# EasyEDA Pro project ProPrj_PDB-F800GS_2025-04-13.epro, schematic Schematic1

## Sheets
1 Power: Board Name: Board1; Create Date: 2025-03-15; Page Name: Power; Project Name: PDB-F800GS; Schematic Name: Schematic1; Update Date: 2025-03-16; Company: EasyEDA.com; Page Size: A4; Version: V1.0
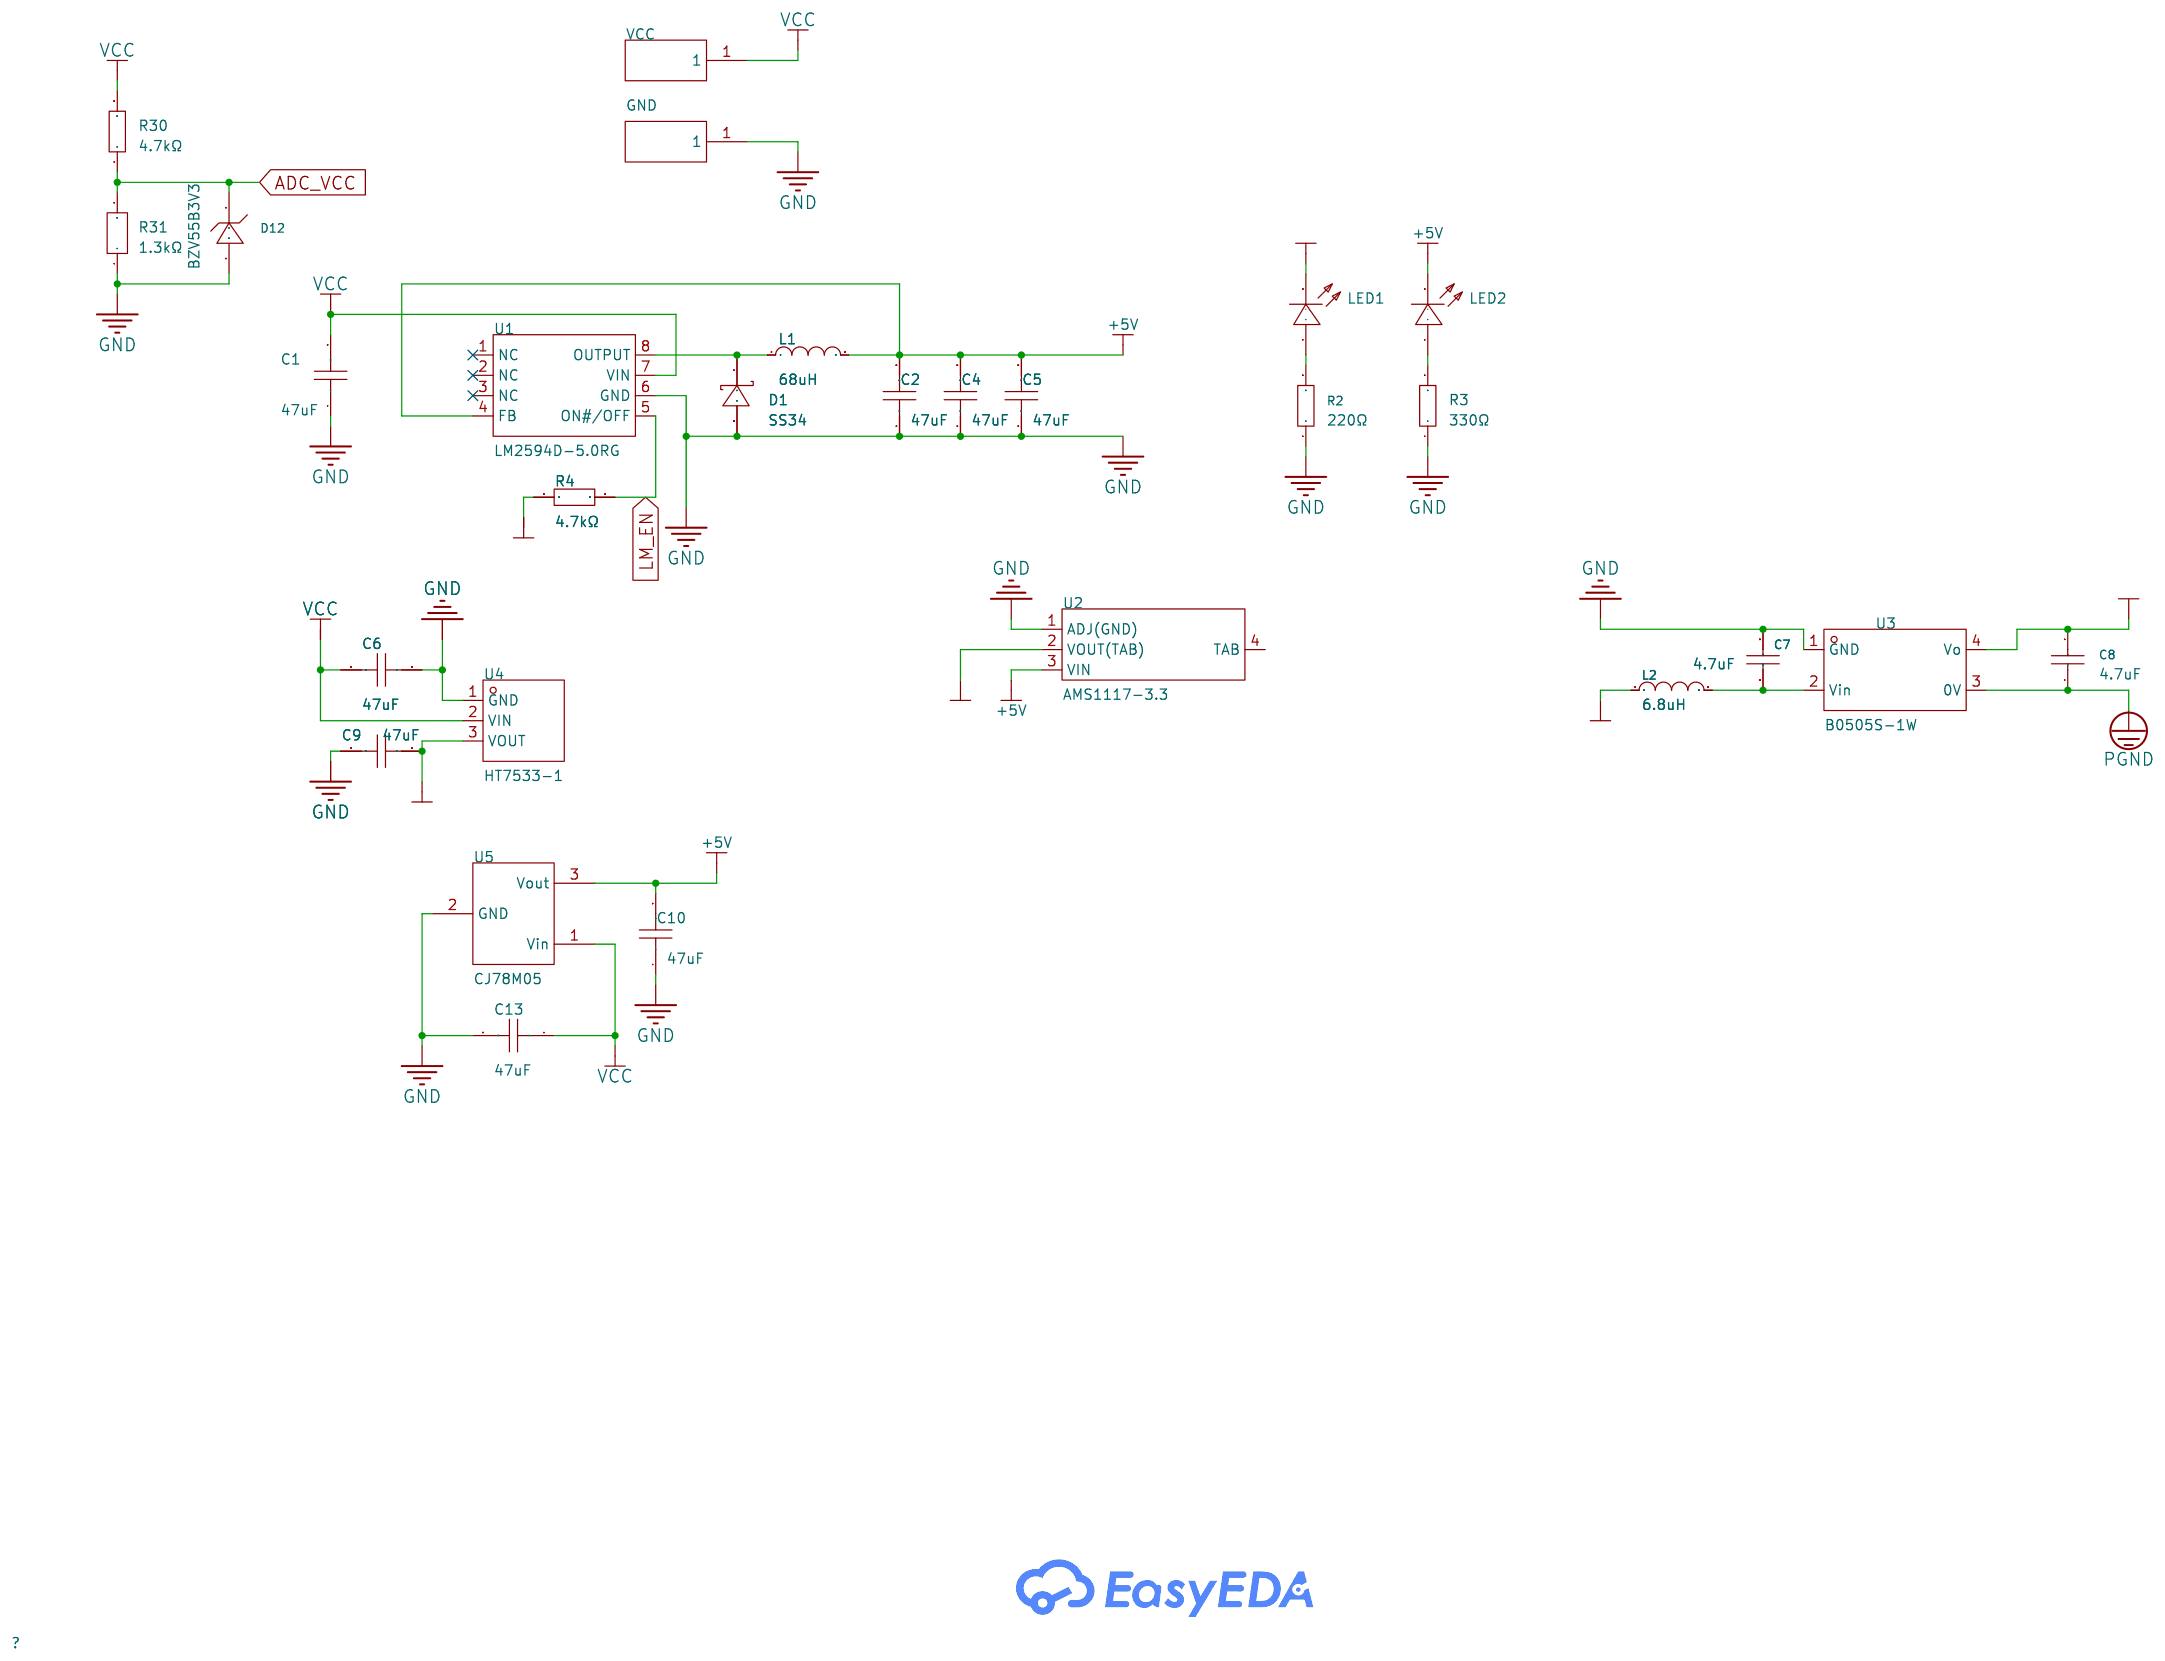
[diagram p0: Power]
2 Ports: Page Name: Ports
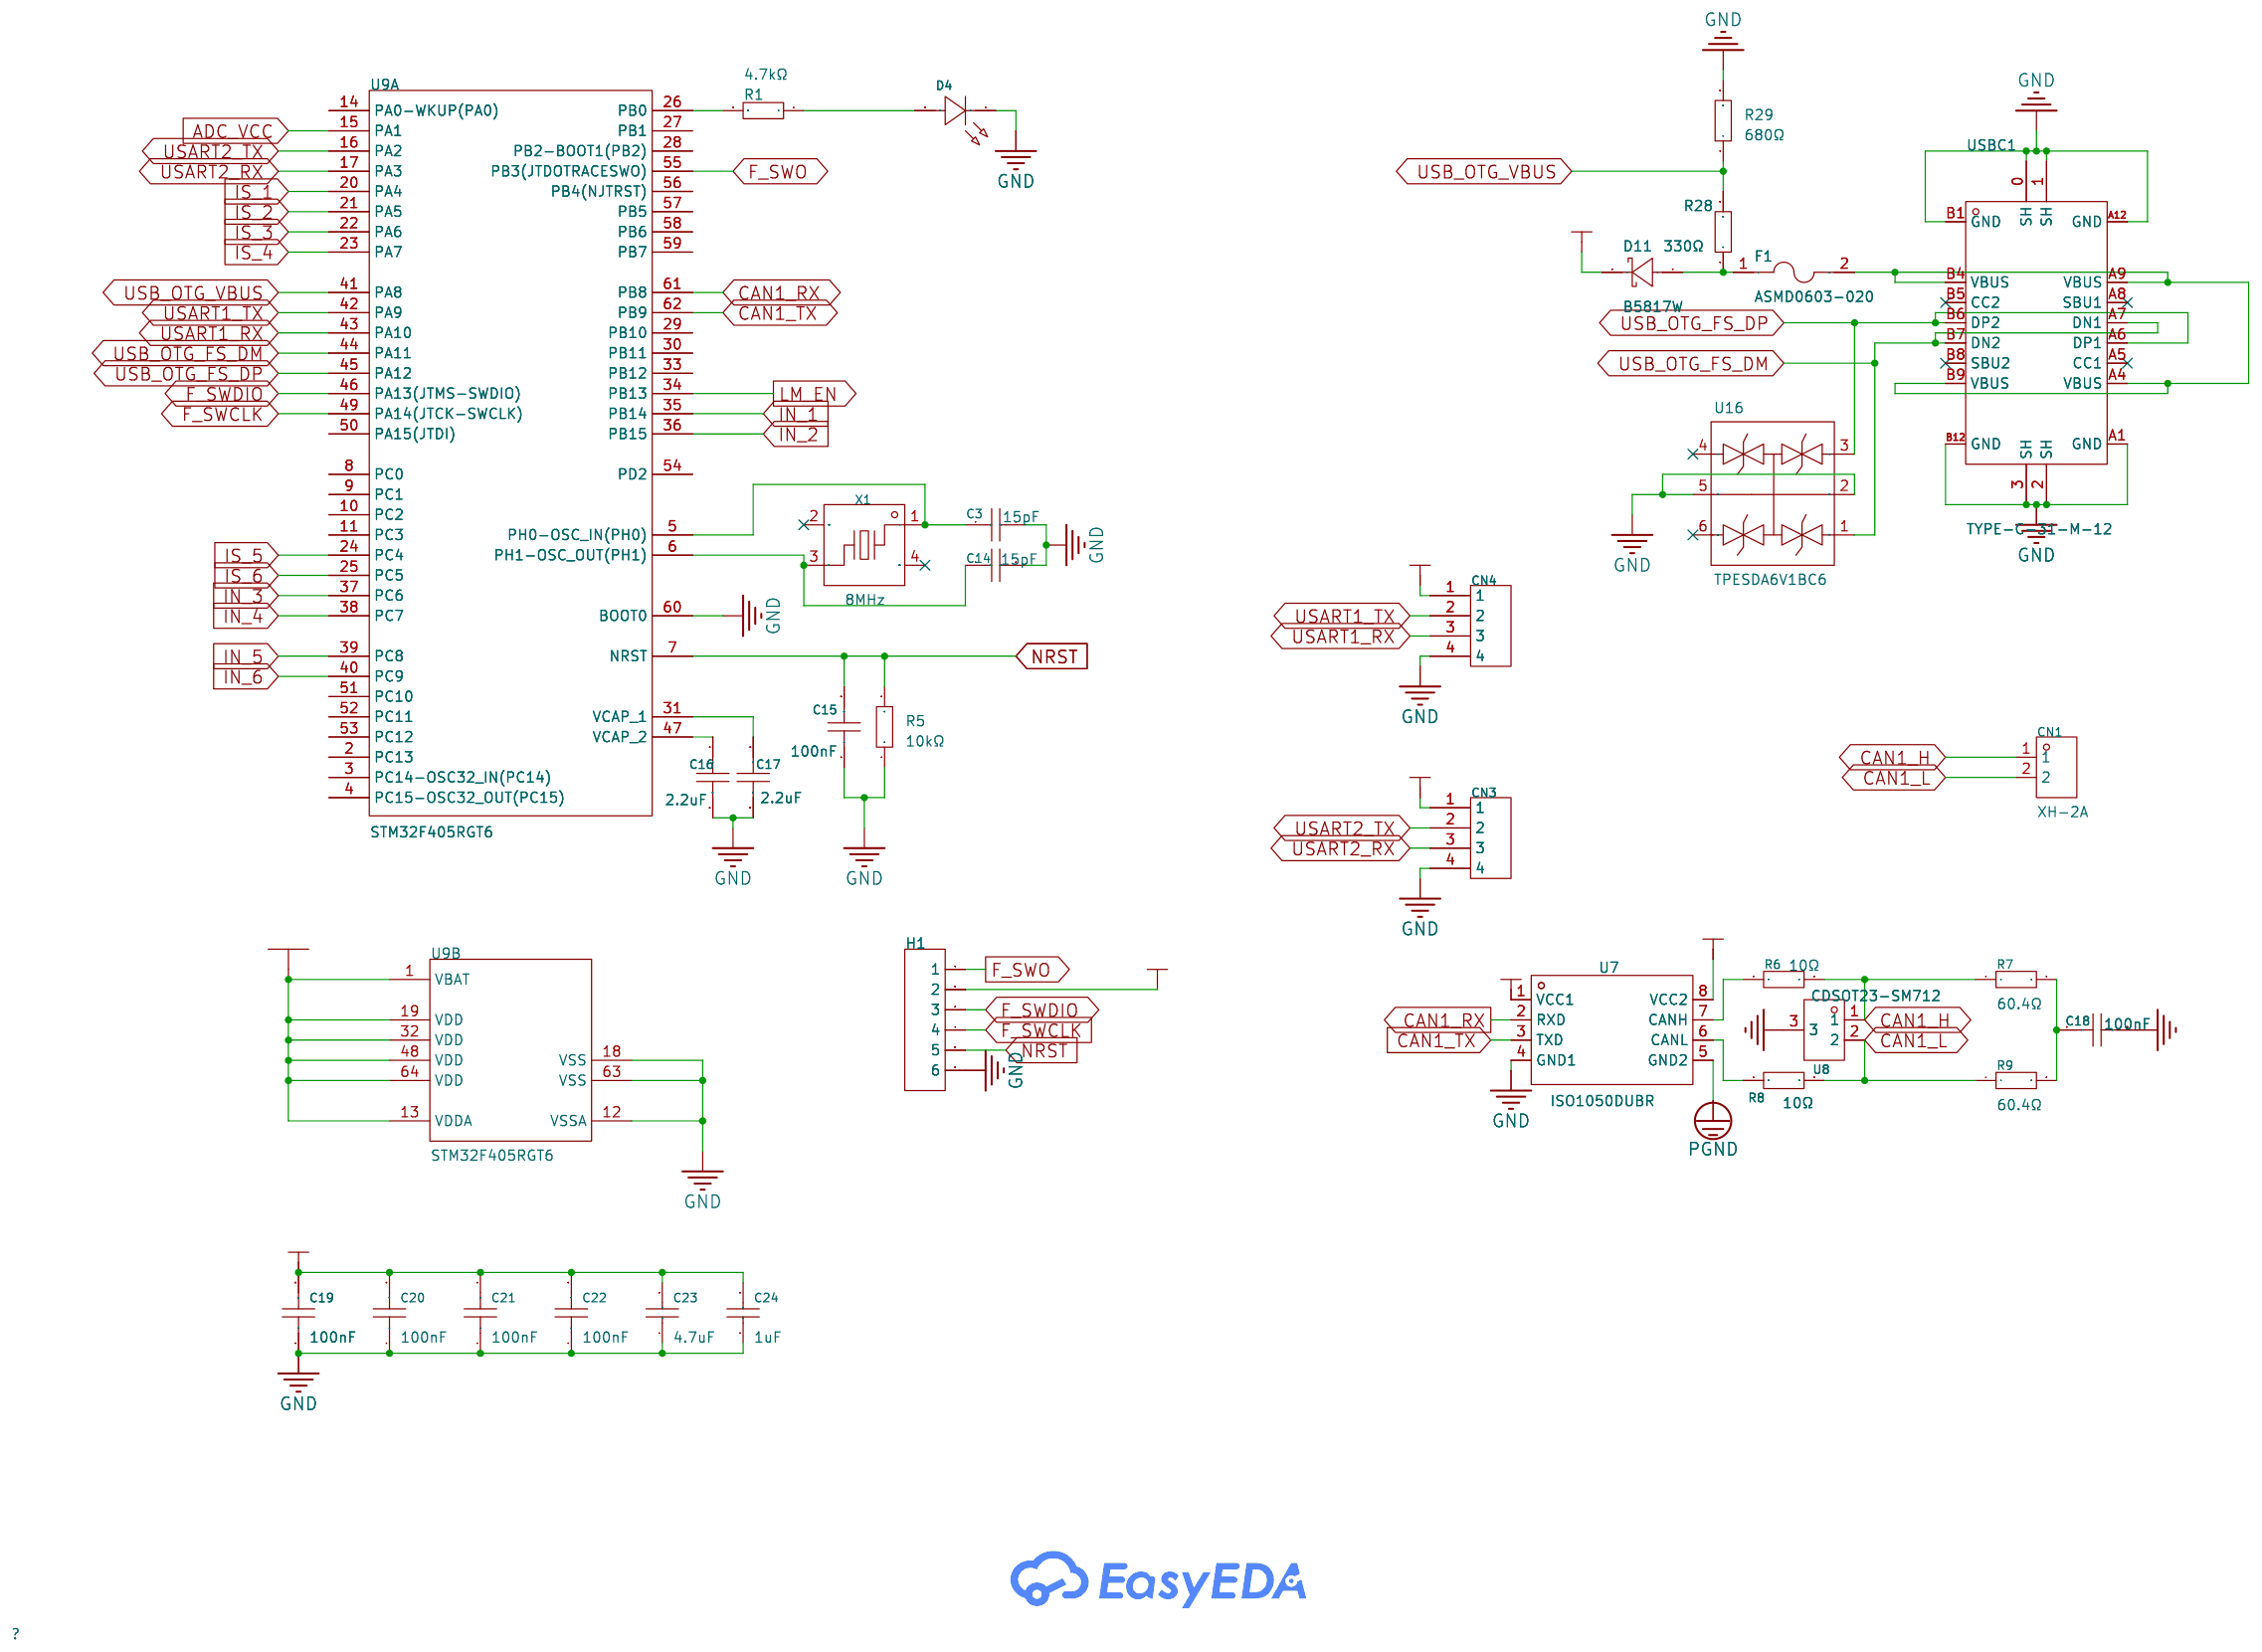
[diagram p1: Ports]
3 P3: Page Name: P3
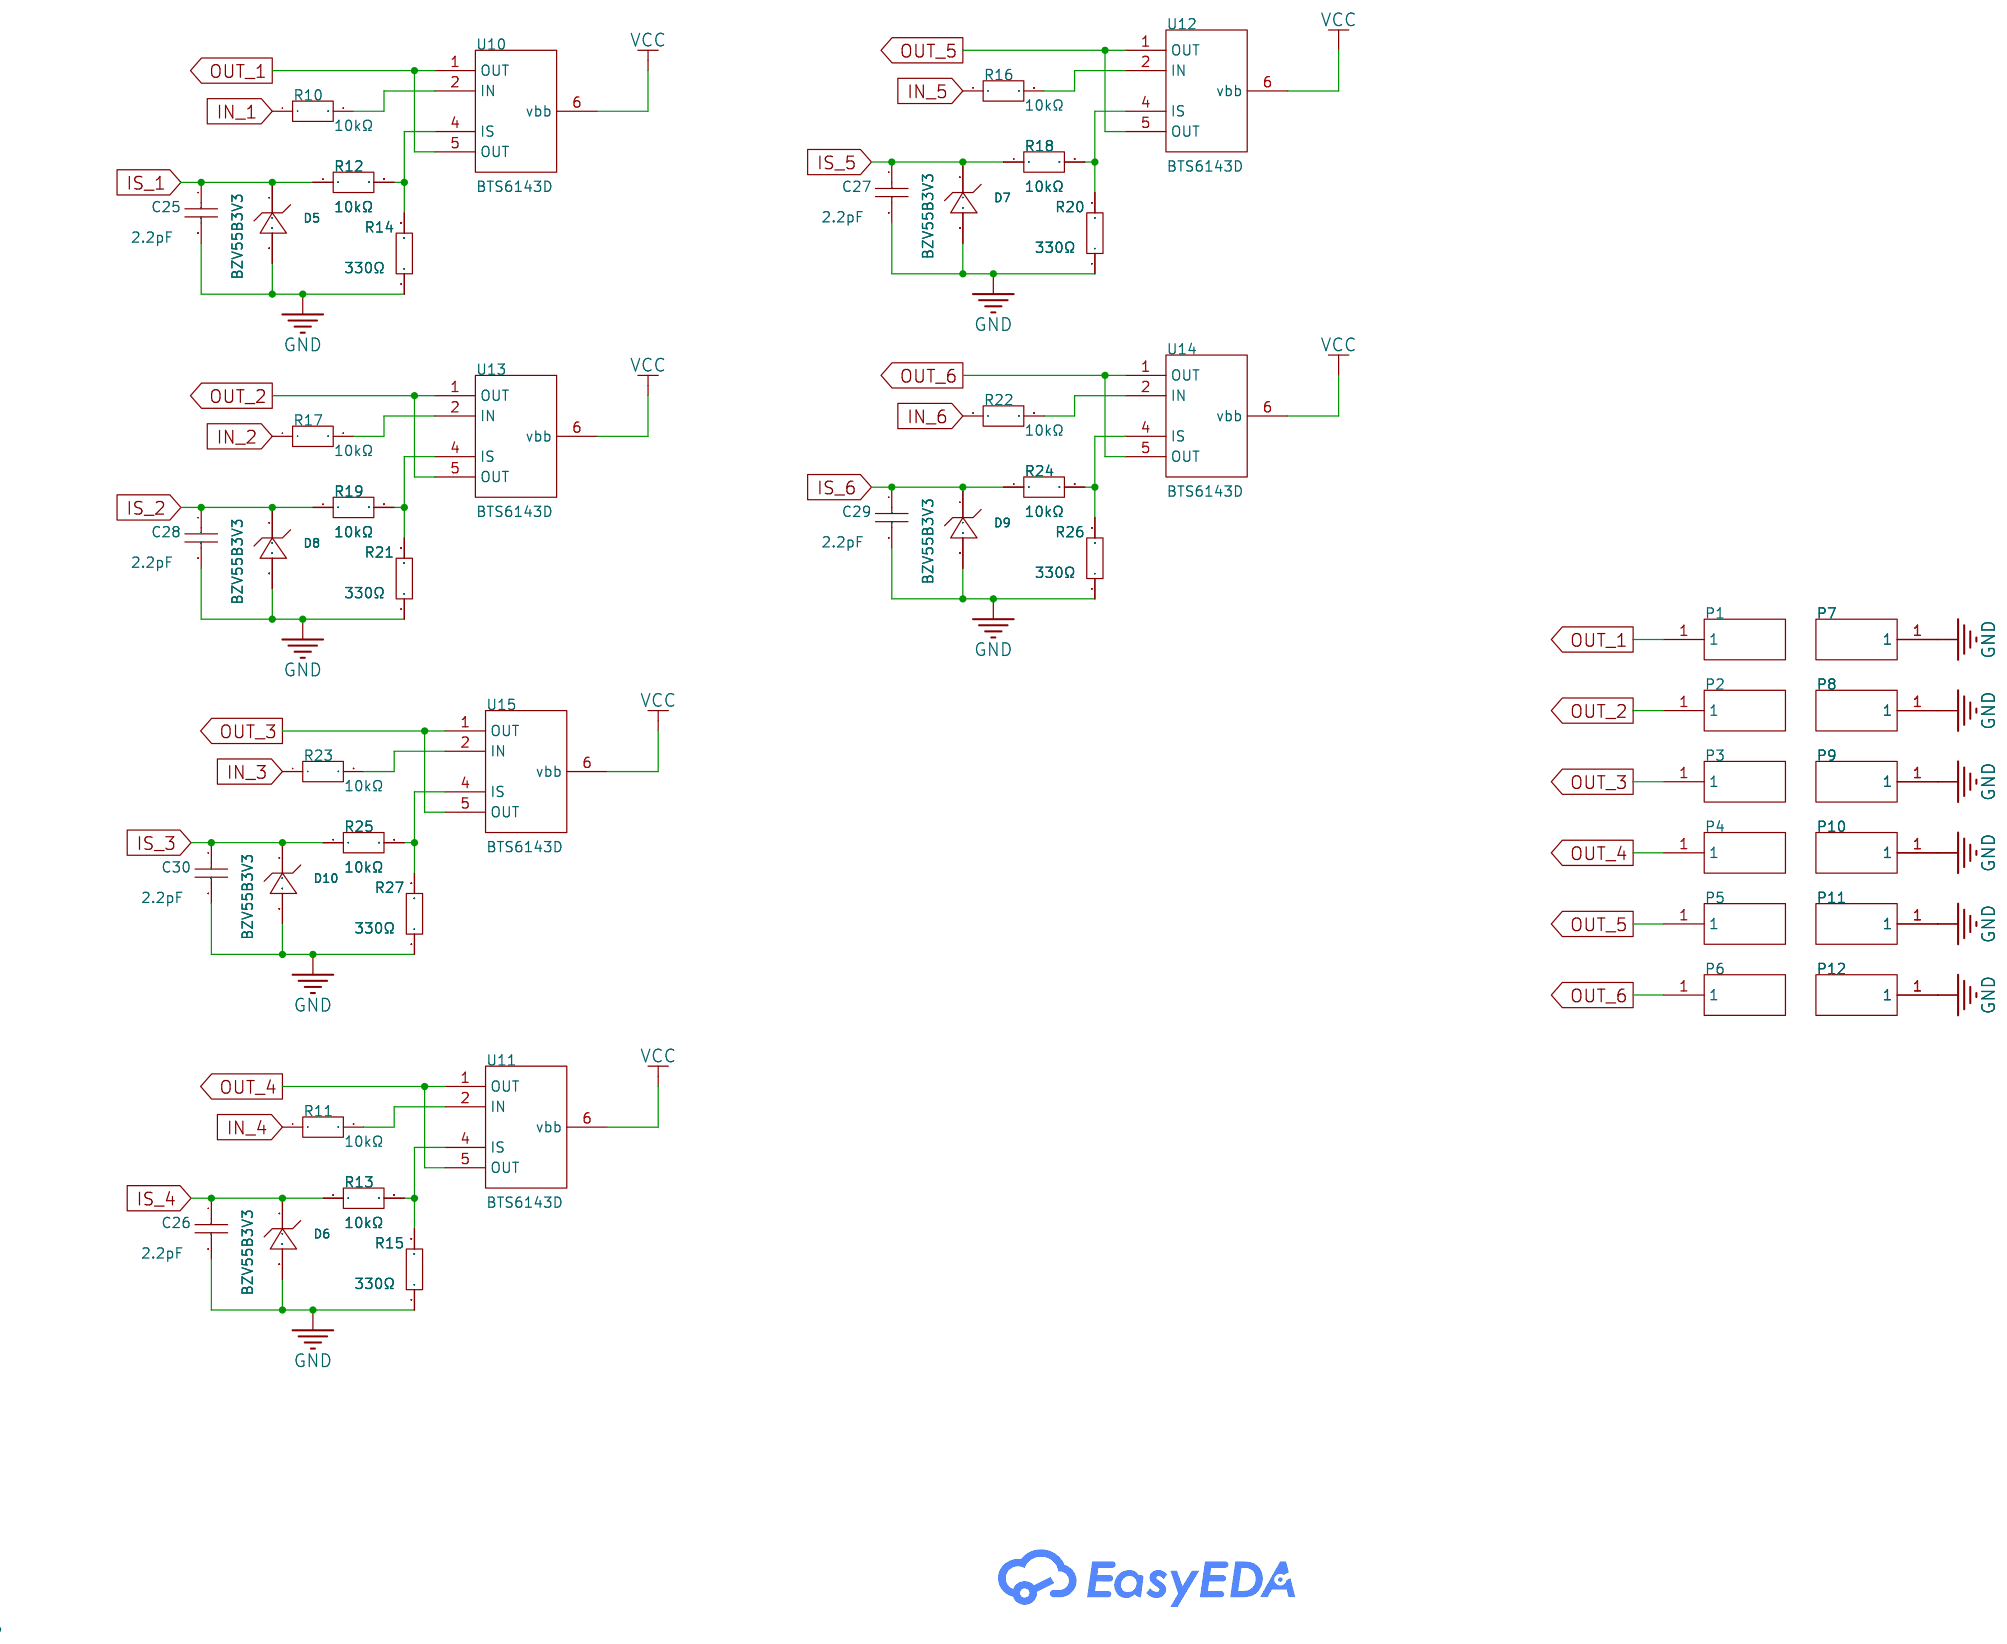
[diagram p2: P3]

## Parts
sheet P3
C25  2.2pF  [C0603]
C26  2.2pF  [C0603]
C27  2.2pF  [C0603]
C28  2.2pF  [C0603]
C29  2.2pF  [C0603]
C30  2.2pF  [C0603]
D5  BZV55B3V3  [SOD-80_L3.5-W1.5-RD]
D6  BZV55B3V3  [SOD-80_L3.5-W1.5-RD]
D7  BZV55B3V3  [SOD-80_L3.5-W1.5-RD]
D8  BZV55B3V3  [SOD-80_L3.5-W1.5-RD]
D9  BZV55B3V3  [SOD-80_L3.5-W1.5-RD]
D10  BZV55B3V3  [SOD-80_L3.5-W1.5-RD]
P1  -  [Wire pad 2x5 footprint]
P2  -  [Wire pad 2x5 footprint]
P3  -  [Wire pad 2x5 footprint]
P4  -  [Wire pad 2x5 footprint]
P5  -  [Wire pad 2x5 footprint]
P6  -  [Wire pad 2x5 footprint]
P7  -  [Wire pad 2x5 footprint]
P8  -  [Wire pad 2x5 footprint]
P9  -  [Wire pad 2x5 footprint]
P10  -  [Wire pad 2x5 footprint]
P11  -  [Wire pad 2x5 footprint]
P12  -  [Wire pad 2x5 footprint]
R10  10kΩ  [R0603]
R11  10kΩ  [R0603]
R12  10kΩ  [R0603]
R13  10kΩ  [R0603]
R14  330Ω  [R0603]
R15  330Ω  [R0603]
R16  10kΩ  [R0603]
R17  10kΩ  [R0603]
R18  10kΩ  [R0603]
R19  10kΩ  [R0603]
R20  330Ω  [R0603]
R21  330Ω  [R0603]
R22  10kΩ  [R0603]
R23  10kΩ  [R0603]
R24  10kΩ  [R0603]
R25  10kΩ  [R0603]
R26  330Ω  [R0603]
R27  330Ω  [R0603]
U10  BTS6143D  [TO-252-5_L6.5-W6.1-P1.14-LS10.0-BR]
U11  BTS6143D  [TO-252-5_L6.5-W6.1-P1.14-LS10.0-BR]
U12  BTS6143D  [TO-252-5_L6.5-W6.1-P1.14-LS10.0-BR]
U13  BTS6143D  [TO-252-5_L6.5-W6.1-P1.14-LS10.0-BR]
U14  BTS6143D  [TO-252-5_L6.5-W6.1-P1.14-LS10.0-BR]
U15  BTS6143D  [TO-252-5_L6.5-W6.1-P1.14-LS10.0-BR]
sheet Ports
C3  15pF  [C0603]
C14  15pF  [C0603]
C15  100nF  [C0603]
C16  2.2uF  [C0603]
C17  2.2uF  [C0603]
C18  100nF  [C0603]
C19  100nF  [C0603]
C20  100nF  [C0603]
C21  100nF  [C0603]
C22  100nF  [C0603]
C23  4.7uF  [C0603]
C24  1uF  [C0603]
CN1  XH-2A  [CONN-TH_XH-2A_C722856]
CN3  XH-4A  [CONN-TH_4P-P2.50_XH-4A]
CN4  XH-4A  [CONN-TH_4P-P2.50_XH-4A]
D4  XL-1608SURC-06  [LED0603-RD_RED]
D11  B5817W  [SOD-123_L2.7-W1.6-LS3.7-FD]
F1  ASMD0603-020  [F0603]
H1  2.54-1x6P直针  [HDR-TH_6P-P2.54-V-M-1]
R1  4.7kΩ  [R0603]
R5  10kΩ  [R0603]
R6  10Ω  [R0603]
R7  60.4Ω  [R0603]
R8  10Ω  [R0603]
R9  60.4Ω  [R0603]
R28  330Ω  [R0603]
R29  680Ω  [R0603]
U7  ISO1050DUBR  [SOIC-8_L9.3-W6.6-P2.54-LS10.4-BL]
U8  CDSOT23-SM712  [SOT-23-3_L2.9-W1.3-P0.95-LS2.4-BR]
U9  STM32F405RGT6  [LQFP-64_L10.0-W10.0-P0.50-LS12.0-BL]  (sections 1,2)
U16  TPESDA6V1BC6  [TSOT-23-6_L2.9-W1.6-P0.95-LS2.8-BL]
USBC1  TYPE-C-31-M-12  [USB-C_SMD-TYPE-C-31-M-12]
X1  8MHz  [OSC-SMD_4P-L3.2-W2.5-BL]
sheet Power
C1  47uF  [C1206]
C2  47uF  [C0805]
C4  47uF  [C0805]
C5  47uF  [C0805]
C6  47uF  [C1206]
C7  4.7uF  [C0603]
C8  4.7uF  [C0603]
C9  47uF  [C0805]
C10  47uF  [C0805]
C13  47uF  [C1206]
D1  SS34  [SMA_L4.3-W2.6-LS5.2-RD]
D12  BZV55B3V3  [SOD-80_L3.5-W1.5-RD]
GND  -  [Wire pad 2.54 x 6.35 footprint]
L1  68uH  [IND-SMD_L8.5-W8.0_SMS0850]
L2  6.8uH  [L0805]
LED1  SZYY0603Y  [LED0603-R-RD_YELLOW]
LED2  SZYY0603Y  [LED0603-R-RD_YELLOW]
R2  220Ω  [R0603]
R3  330Ω  [R0603]
R4  4.7kΩ  [R0603]
R30  4.7kΩ  [R0603]
R31  1.3kΩ  [R0603]
U1  LM2594D-5.0RG  [SOP-8_L4.9-W3.9-P1.27-LS6.0-BL]
U2  AMS1117-3.3  [SOT-223-4_L6.5-W3.5-P2.30-LS7.0-BR]
U3  B0505S-1W  [PWRM-TH_BXXXXS-1WR3]
U4  HT7533-1  [SOT-89_L4.5-W2.5-P1.50-LS4.2-BR]
U5  CJ78M05  [TO-252-3_L6.5-W5.8-P4.58-TL]
VCC  -  [Wire pad 2.54 x 6.35 footprint]

## Library data of the parts
C25-C30 = 0603CG2R2C500NT: Capacitance: Voltage Rated: Temperature Coefficient:; LCSC Part Name: 2.2pF 50V; Supplier Part: C1651; Manufacturer: FH(风华); Supplier Footprint: 0603; JLCPCB Part Class: Extended Part; Datasheet: https://atta.szlcsc.com/upload/public/pdf/source/20200305/C486355_26A10D38EF8C2A5C37091D0039909270.pdf; Supplier: LCSC
D5-D10 D12 = BZV55B3V3: Diode Configuration:Single Zener Voltage (Nom):- Reverse Leakage Current (Ir):2uA@1V Zener Voltage (Range):3.23V~3.37V Zener Voltage (Range):3.23V~3.37V Power Dissipation:500mW Zener Impedance (Zzt):85Ω Tolerance:- Tolerance:-; Supplier Part: C545375; Manufacturer: LGE(鲁光); Supplier Footprint: SOD-80; JLCPCB Part Class: Extended Part; Datasheet: https://atta.szlcsc.com/upload/public/pdf/source/20200521/C545327_60D3A6779D4B17AB00B9D32EC53EDD92.pdf; Supplier: LCSC; Diode Configuration: Single; Reverse Leakage Current (Ir): 2uA@1V; Zener Voltage (Range): 3.23V~3.37V; Power Dissipation: 500mW; Zener Impedance (Zzt): 85Ω
P1-P12 = Wire Pad 2x5
R10-R13 R16-R19 R22-R25 = FRC0603J103TS: Type:Thick Film Resistors Resistance:10kΩ Tolerance:±5% Tolerance:±5% Power(Watts): Overload Voltage (Max): Temperature Coefficient:±100ppm/℃ Temperature Coefficient:±100ppm/℃ Operating Temperature Range:-55℃~+155℃ Operating Temperature Range:-55℃~+155℃; LCSC Part Name: 10kΩ ±5% 100mW 厚膜电阻; Supplier Part: C2930027; Manufacturer: FOJAN(富捷); Supplier Footprint: 0603; JLCPCB Part Class: Extended Part; Datasheet: https://atta.szlcsc.com/upload/public/pdf/source/20211221/925EC7D7225764EE0046F22065062C87.pdf; Supplier: LCSC; Type: Thick Film Resistors; Tolerance: ±5%; Temperature Coefficient: ±100ppm/℃; Operating Temperature Range: -55℃~+155℃
R14 R15 R20 R21 R26-R28 = 0603WAF3300T5E: Type:Thick Film Resistors Resistance: Tolerance:±1% Tolerance:±1% Power(Watts): Overload Voltage (Max): Temperature Coefficient:±100ppm/℃ Temperature Coefficient:±100ppm/℃ Operating Temperature Range:-55℃~+155℃ Operating Temperature Range:-55℃~+155℃; LCSC Part Name: 330Ω ±1% 100mW 厚膜电阻; Supplier Part: C23138; Manufacturer: UNI-ROYAL(厚声); Supplier Footprint: 0603; JLCPCB Part Class: Basic Part; Datasheet: https://atta.szlcsc.com/upload/public/pdf/source/20200306/C422600_1E6D84923E4A46A82E41ADD87F860B5C.pdf; Supplier: LCSC; Type: Thick Film Resistors; Tolerance: ±1%; Temperature Coefficient: ±100ppm/℃; Operating Temperature Range: -55℃~+155℃
U10-U15 = BTS6143D: Type:High-side switch Number of Channels:1 Control Input Logic:Active Low Output Current:33A Voltage - Supply:5.5V~38V Voltage - Supply:5.5V~38V RDS(on):10mΩ Operating Temperature	-:-40℃~+150℃ Operating Temperature	-:-40℃~+150℃; Supplier Part: C95232; Manufacturer: Infineon(英飞凌); Supplier Footprint: TO-252-4; JLCPCB Part Class: Extended Part; Datasheet: https://atta.szlcsc.com/upload/public/pdf/source/20170217/1487301594741.pdf; Supplier: LCSC; Type: High-side switch; Number of Channels: 1; Control Input Logic: Active Low; Output Current: 33A; Voltage - Supply: 5.5V~38V; RDS(on): 10mΩ; Operating Temperature	-: -40℃~+150℃
C3 C14 = CC0603JRNPO9BN150: Capacitance: Tolerance:±5% Tolerance:±5% Voltage Rated: Temperature Coefficient:; LCSC Part Name: 15pF ±5% 50V; Supplier Part: C107037; Manufacturer: YAGEO(国巨); Supplier Footprint: 0603; JLCPCB Part Class: Extended Part; Datasheet: https://atta.szlcsc.com/upload/public/pdf/source/20170914/C128857_1505359892143968080.pdf; Supplier: LCSC; Tolerance: ±5%
C15 C18-C22 = CL10B104KC8NNNC: Capacitance: Tolerance:±10% Tolerance:±10% Voltage Rated: Temperature Coefficient:; LCSC Part Name: 100nF ±10% 100V; Supplier Part: C15725; Manufacturer: SAMSUNG(三星); Supplier Footprint: 0603; JLCPCB Part Class: Extended Part; Datasheet: https://atta.szlcsc.com/upload/public/pdf/source/20160218/1457707763339.pdf; Supplier: LCSC; Tolerance: ±10%
C16 C17 = CL10A225KB8NNNC: Capacitance: Tolerance:±10% Tolerance:±10% Voltage Rated: Temperature Coefficient:; LCSC Part Name: 2.2uF ±10% 50V; Supplier Part: C913904; Manufacturer: SAMSUNG(三星); Supplier Footprint: 0603; JLCPCB Part Class: Extended Part; Datasheet: https://atta.szlcsc.com/upload/public/pdf/source/20160218/1457707763339.pdf; Supplier: LCSC; Tolerance: ±10%
C7 C8 C23 = CL10A475KO8NNNC: Capacitance: Tolerance:±10% Tolerance:±10% Voltage Rated: Temperature Coefficient:; LCSC Part Name: 4.7uF ±10% 16V; Supplier Part: C19666; Manufacturer: SAMSUNG(三星); Supplier Footprint: 0603; JLCPCB Part Class: Basic Part; Datasheet: https://atta.szlcsc.com/upload/public/pdf/source/20160218/1457707763339.pdf; Supplier: LCSC; Tolerance: ±10%
C24 = CL10A105KO8NNNC: Capacitance: Tolerance:±10% Tolerance:±10% Voltage Rated: Temperature Coefficient:; LCSC Part Name: 1uF ±10% 16V; Supplier Part: C1592; Manufacturer: SAMSUNG(三星); Supplier Footprint: 0603; JLCPCB Part Class: Extended Part; Datasheet: https://atta.szlcsc.com/upload/public/pdf/source/20220919/9FBE606BE0D9532D730F292EB26DC5BB.pdf; Supplier: LCSC; Tolerance: ±10%
CN1 = XH-2A_C722856: Pins Structure:1x2P Pitch:2.5mm Mounting Style:Straight Reference Series:- Number of Pins:2P Number of Rows:1 Number of PINs Per Row:2 Row Spacing:- Current Rating (Max):2A Operating Temperature Range:-25℃~+85℃ Operating Temperature Range:-25℃~+85℃; LCSC Part Name: 1x2P 间距:2.5mm 直插; Supplier Part: C722856; Manufacturer: CAX(创都); Supplier Footprint: 插件,P=2.5mm; JLCPCB Part Class: Extended Part; Datasheet: https://atta.szlcsc.com/upload/public/pdf/source/20200831/C722856_9D7340CDD20AA9916EABC83BD7BA9E94.pdf; Supplier: LCSC; Pins Structure: 1x2P; Pitch: 2.5mm; Mounting Style: Straight; Number of Pins: 2P; Number of Rows: 1; Number of PINs Per Row: 2; Current Rating (Max): 2A; Operating Temperature Range: -25℃~+85℃
CN3 CN4 = XH-4A_C37815: Pins Structure:1x4P Pitch:2.5mm Mounting Style:- Reference Series:XH Number of Pins:4P Number of Rows:1 Number of PINs Per Row:4 Row Spacing:- Contact Material:Phosphor bronze; LCSC Part Name: 系列:XH 间距:2.5mm 1x4P; Supplier Part: C37815; Manufacturer: BOOMELE(博穆精密); Supplier Footprint: 插件,P=2.5mm; JLCPCB Part Class: Extended Part; Datasheet: https://atta.szlcsc.com/upload/public/pdf/source/20181205/C146112_2CB31444E6250AC61E2A41A9A8391D5F.pdf; Supplier: LCSC; Pins Structure: 1x4P; Pitch: 2.5mm; Reference Series: XH; Number of Pins: 4P; Number of Rows: 1; Number of PINs Per Row: 4; Contact Material: Phosphor bronze
D4 = XL-1608SURC-06: Emitted Color:Red Power Dissipation:55mW Forward Current:25mA Dominant Wavelength:617nm~621nm Dominant Wavelength:617nm~621nm Peak Wavelength:623nm Lens Color:无色透明透镜 Color Temperature:- Color Temperature:- Viewing Angle:120° Mounting Sytle:Positive post O; Supplier Part: C965799; Manufacturer: XINGLIGHT(成兴光); Supplier Footprint: 0603; JLCPCB Part Class: Extended Part; Datasheet: https://atta.szlcsc.com/upload/public/pdf/source/20221102/D860AFDD1CDB02C5A8064103A32707E2.pdf; Supplier: LCSC; Emitted Color: Red; Power Dissipation: 55mW; Forward Current: 25mA; Dominant Wavelength: 617nm~621nm; Peak Wavelength: 623nm; Lens Color: 无色透明透镜; Viewing Angle: 120°; Mounting Sytle: Positive post; Operating Temperature: -30℃~+85℃
D11 = B5817W_C7420328: Diode Configuration:Independent Type Forward Voltage (Vf@If):450mV@1.0A Reverse Voltage (Vr):20V Rectified Current:1A Reverse Leakage Current (Ir):1mA@20V; LCSC Part Name: 电压:20V 电流:1A; Supplier Part: C7420328; Manufacturer: 宏迦橙; Supplier Footprint: SOD-123; JLCPCB Part Class: Extended Part; Datasheet: https://atta.szlcsc.com/upload/public/pdf/source/20230828/EE0D571642CD3E42C48F1182066654A1.pdf; Supplier: LCSC; Diode Configuration: Independent Type; Forward Voltage (Vf@If): 450mV@1.0A; Reverse Voltage (Vr): 20V; Rectified Current: 1A; Reverse Leakage Current (Ir): 1mA@20V
F1 = ASMD0603-020: Voltage - Max:9V Current - Max:40A Hold Current:200mA Trip Current:500mA Power Dissipation:500mW Resistance - Initial (Ri) (Min):550mΩ Resistance - Post Trip (R1) (Max):3.5Ω Time to Trip(Max):600ms Operating Temperature:-40℃~+85℃ Operating Temperature:-40; LCSC Part Name: 9V 200mA 0603自恢复; Supplier Part: C135321; Manufacturer: JDTfuse(集电通); Supplier Footprint: 0603; JLCPCB Part Class: Extended Part; Datasheet: https://atta.szlcsc.com/upload/public/pdf/source/20230515/E3BD72A3B3566E5D91D9E10B82E096BB.pdf; Supplier: LCSC; Voltage - Max: 9V; Current - Max: 40A; Hold Current: 200mA; Trip Current: 500mA; Power Dissipation: 500mW; Resistance - Initial (Ri) (Min): 550mΩ; Resistance - Post Trip (R1) (Max): 3.5Ω; Time to Trip(Max): 600ms; Operating Temperature: -40℃~+85℃
H1 = 2.54-1x6P直针: Pin Structure:1x6P Pitch:2.54mm Row Spacing:- Circluar Pins/Square Pins:Square Pins Mounting Type:Straight Number of Rows:Plugin Number of Pins:6P Current Rating (Max):3A Voltage Rating (Max):- Length of Mating Pin:- Insulation Height:- Contact Material:; LCSC Part Name: 间距:2.54mm 1x6P 直插 方针; Supplier Part: C37208; Manufacturer: BOOMELE(博穆精密); Supplier Footprint: 插件,P=2.54mm; JLCPCB Part Class: Extended Part; Supplier: LCSC; Pin Structure: 1x6P; Pitch: 2.54mm; Circluar Pins/Square Pins: Square Pins; Mounting Type: Straight; Number of Rows: Plugin; Number of Pins: 6P; Current Rating (Max): 3A; Operating Temperature Range: -40℃~+105℃; Color: Black
R1 = RMC06034K7FN: Resistance: Tolerance:±1% Tolerance:±1% Power(Watts):; LCSC Part Name: 4.7kΩ ±1% 100mW; Supplier Part: C269713; Manufacturer: Tyohm(幸亚电阻); Supplier Footprint: 0603; Datasheet: https://atta.szlcsc.com/upload/public/pdf/source/20190115/C325956_D27151D492FFB3C9AB4A6F14FE01F30A.pdf; Supplier: LCSC; Tolerance: ±1%
R5 = FRC0603J103TS: Type:Thick Film Resistors Resistance:10kΩ Tolerance:±5% Tolerance:±5% Power(Watts):0.1W Voltage-Supply(Max):75V Temperature Coefficient:±100ppm/℃ Temperature Coefficient:±100ppm/℃ Operating Temperature:-55℃~+155℃ Operating Temperature:-55℃~+155℃; LCSC Part Name: 10kΩ ±5% 100mW 厚膜电阻; Supplier Part: C2930027; Manufacturer: FOJAN(富捷); Supplier Footprint: 0603; JLCPCB Part Class: Extended Part; Datasheet: https://atta.szlcsc.com/upload/public/pdf/source/20211221/925EC7D7225764EE0046F22065062C87.pdf; Supplier: LCSC; Type: Thick Film Resistors; Tolerance: ±5%; Power(Watts): 0.1W; Temperature Coefficient: ±100ppm/℃; Operating Temperature Range: -55℃~+155℃; Voltage-Supply(Max): 75V; Operating Temperature: -55℃~+155℃
R6 R8 = 0603WAF100JT5E: Type:Thick Film Resistors Resistance:10Ω Tolerance:±1% Tolerance:±1% Power(Watts): Overload Voltage (Max): Temperature Coefficient:±400ppm/℃ Temperature Coefficient:±400ppm/℃ Operating Temperature Range:-55℃~+155℃ Operating Temperature Range:-55℃~+155℃; LCSC Part Name: 10Ω ±1% 100mW 厚膜电阻; Supplier Part: C22859; Manufacturer: UNI-ROYAL(厚声); Supplier Footprint: 0603; JLCPCB Part Class: Basic Part; Datasheet: https://atta.szlcsc.com/upload/public/pdf/source/20200306/C422600_1E6D84923E4A46A82E41ADD87F860B5C.pdf; Supplier: LCSC; Type: Thick Film Resistors; Tolerance: ±1%; Temperature Coefficient: ±400ppm/℃; Operating Temperature Range: -55℃~+155℃
R7 R9 = 0603WAF604JT5E: Type:Thick Film Resistors Resistance:60.4Ω Tolerance:±1% Tolerance:±1% Power(Watts): Overload Voltage (Max): Temperature Coefficient:±100ppm/℃ Temperature Coefficient:±100ppm/℃ Operating Temperature Range:-55℃~+155℃ Operating Temperature Range:-55℃~+155℃; LCSC Part Name: 60.4Ω ±1% 100mW 厚膜电阻; Supplier Part: C23090; Manufacturer: UNI-ROYAL(厚声); Supplier Footprint: 0603; JLCPCB Part Class: Extended Part; Datasheet: https://atta.szlcsc.com/upload/public/pdf/source/20200306/C422600_1E6D84923E4A46A82E41ADD87F860B5C.pdf; Supplier: LCSC; Type: Thick Film Resistors; Tolerance: ±1%; Temperature Coefficient: ±100ppm/℃; Operating Temperature Range: -55℃~+155℃
R29 = RC0603FR-07680RL: Type:Thick Film Resistors Resistance: Tolerance:±1% Tolerance:±1% Power(Watts): Overload Voltage (Max): Temperature Coefficient:±100ppm/℃ Temperature Coefficient:±100ppm/℃ Operating Temperature Range:-55℃~+155℃ Operating Temperature Range:-55℃~+155℃; LCSC Part Name: 厚膜电阻 680Ω ±1% 100mW; Supplier Part: C112310; Manufacturer: YAGEO(国巨); Supplier Footprint: 0603; JLCPCB Part Class: Extended Part; Datasheet: https://atta.szlcsc.com/upload/public/pdf/source/20180821/C275644_0D56F95EFF785E7D9A1FEF436B37DA78.pdf; Supplier: LCSC; Type: Thick Film Resistors; Tolerance: ±1%; Temperature Coefficient: ±100ppm/℃; Operating Temperature Range: -55℃~+155℃
U7 = ISO1050DUBR: Type:Transceiver；隔离器 Data Rate:1Mbps Supply Voltage:3V~5.5V Supply Voltage:3V~5.5V Operating Temperature:-55℃~+105℃ Operating Temperature:-55℃~+105℃; LCSC Part Name: 1Mbps 3V~5.5V; Supplier Part: C16428; Manufacturer: TI(德州仪器); Supplier Footprint: SOP-8; JLCPCB Part Class: Extended Part; Datasheet: https://www.ti.com/cn/lit/gpn/iso1050; Supplier: LCSC; Type: Transceiver；隔离器; Data Rate: 1Mbps; Supply Voltage: 3V~5.5V; Operating Temperature: -55℃~+105℃
U8 = CDSOT23-SM712: Type:ESD; Supplier Part: C5122012; Manufacturer: TECH PUBLIC(台舟); Supplier Footprint: SOT-23; JLCPCB Part Class: Extended Part; Datasheet: https://atta.szlcsc.com/upload/public/pdf/source/20220803/4A9C0E34EEAC943B05340E9DB1D959A9.pdf; Supplier: LCSC; Type: ESD
U9 = STM32F405RGT6: CPU Core:CM4 Program Storage Size:1MB RAM Size:192KB GPIO Ports Number:51 Operating Voltage Range:1.8V~3.6V Operating Voltage Range:1.8V~3.6V CPU Maximum Speed:168MHz Program Memory Type:FLASH Operating Temperature Range:-40℃~+85℃ Operating Temperature Ra; Supplier Part: C15742; Manufacturer: ST(意法半导体); Supplier Footprint: LQFP-64(10x10); JLCPCB Part Class: Extended Part; Datasheet: https://atta.szlcsc.com/upload/public/pdf/source/20140801/1457707197138.pdf; Supplier: LCSC; CPU Core: CM4; Program Storage Size: 1MB; RAM Size: 192KB; GPIO Ports Number: 51; Operating Voltage Range: 1.8V~3.6V; CPU Maximum Speed: 168MHz; Program Memory Type: FLASH; Operating Temperature Range: -40℃~+85℃; ADC (Bit): 12bit; DAC (Bit): 12bit; Universal Serial Bus: 有; Peripheral/Function: DMA；LCD/LED驱动；PWM; Watchdog: 有; Infrared Data Association: 有; Low-Voltage Detect: 有; LCD Module: 有; Direct Memory Access: 有; Internal Oscillator: 有
U16 = TPESDA6V1BC6: Type:ESD; Supplier Part: C2875148; Manufacturer: TECH PUBLIC(台舟); Supplier Footprint: SOT-23-6; JLCPCB Part Class: Extended Part; Datasheet: https://atta.szlcsc.com/upload/public/pdf/source/20210810/C55031002623491481710CD7E7D23AAB.pdf; Supplier: LCSC; Type: ESD
USBC1 = TYPE-C-31-M-12: Connector Type:Type-C Standard:- Gender:Female Mounting Style:- Number of Contacts:16P Number of Ports:1 Current Rating - Power (Max):5A Operating Temperature Range:- Operating Temperature Range:-; LCSC Part Name: Type-C 母; Supplier Part: C165948; Manufacturer: 韩国韩荣; Supplier Footprint: SMD; JLCPCB Part Class: Extended Part; Datasheet: https://atta.szlcsc.com/upload/public/pdf/source/20220525/466408E853115E789EDB0DDC29077C05.pdf; Supplier: LCSC; Connector Type: Type-C; Gender: Female; Number of Contacts: 16P; Number of Ports: 1; Current Rating - Power (Max): 5A
X1 = 7B008000R01: Crystal Type:贴片晶振 Frequency:8MHz Normal temperature Frequency Tolerance:±10ppm Normal temperature Frequency Tolerance:±10ppm External load capacitor: Frequency Stability(Full temperature range):±20ppm Frequency Stability(Full temperature range):±20ppm Ope; LCSC Part Name: 8MHz ±10ppm 20pF; Supplier Part: C648987; Manufacturer: HD(浩都频率); Supplier Footprint: SMD3225-4P; JLCPCB Part Class: Extended Part; Datasheet: https://atta.szlcsc.com/upload/public/pdf/source/20220223/7C7964CAF9116EA4C2B1AA35060C0EC3.pdf; Supplier: LCSC; Crystal Type: 贴片晶振; Normal temperature Frequency Tolerance: ±10ppm; Frequency Stability(Full temperature range): ±20ppm
C1 C6 C13 = HGC1206R5476M250NSPJ: Capacitance: Tolerance:±20% Tolerance:±20% Voltage Rated: Temperature Coefficient:; LCSC Part Name: 47uF ±20% 25V; Supplier Part: C22367835; Manufacturer: Chinocera(华瓷); Supplier Footprint: 1206; JLCPCB Part Class: Extended Part; Datasheet: https://atta.szlcsc.com/upload/public/pdf/source/20240326/E6CB0DC43BB858B74F4352229FABFDCA.pdf; Supplier: LCSC; Tolerance: ±20%
C2 C4 C5 C9 C10 = CGA0805X5R476M100MT: Capacitance:47uF Tolerance:±20% Tolerance:±20% Voltage Rated: Temperature Coefficient:; LCSC Part Name: 47uF ±20% 10V; Supplier Part: C6119904; Manufacturer: HRE(芯声); Supplier Footprint: 0805; JLCPCB Part Class: Extended Part; Supplier: LCSC; Tolerance: ±20%
D1 = SS34_C8678: Diode Configuration:Independent Type Forward Voltage (Vf@If):550mV@3A Reverse Voltage (Vr):40V Rectified Current:3A Reverse Leakage Current (Ir):500uA@40V; LCSC Part Name: 电压:40V 电流:3A; Supplier Part: C8678; Manufacturer: MDD(辰达半导体); Supplier Footprint: SMA(DO-214AC); JLCPCB Part Class: Basic Part; Datasheet: https://atta.szlcsc.com/upload/public/pdf/source/20240710/2118BB86FDDB2E0B294389AC1F3F65C8.pdf; Supplier: LCSC; Diode Configuration: Independent Type; Forward Voltage (Vf@If): 550mV@3A; Reverse Voltage (Vr): 40V; Rectified Current: 3A; Reverse Leakage Current (Ir): 500uA@40V
GND VCC = Wire pad 2.54x6.35
L1 = ZEMS0850-680M: Inductance: Tolerance:±20% Tolerance:±20% Rated Current:2A Saturation Current (Isat):3A DC Resistance (DCR): Type:Integrated molded inductor; Supplier Part: C41415633; Manufacturer: ZE(增益); Supplier Footprint: SMD,8.5x8mm; JLCPCB Part Class: Extended Part; Datasheet: https://atta.szlcsc.com/upload/public/pdf/source/20241008/AAC43C4973D31889D16F2FED183ADF70.pdf; Supplier: LCSC; Tolerance: ±20%; Rated Current: 2A; Saturation Current (Isat): 3A; Type: Integrated molded inductor
L2 = MLZ2012M6R8WT000: Inductance: Tolerance:±20% Tolerance:±20% Rated Current:- Saturation Current (Isat):220mA DC Resistance (DCR): Q @ Freq:- Frequency - Self Resonant:- Ratings:; LCSC Part Name: 6.8uH ±20% 220mA; Supplier Part: C383410; Manufacturer: TDK; Supplier Footprint: 0805; JLCPCB Part Class: Extended Part; Datasheet: https://atta.szlcsc.com/upload/public/pdf/source/20200324/C383404_6F95903E86AEDF16368640ABB3D81E0E.pdf; Supplier: LCSC; Tolerance: ±20%; Saturation Current (Isat): 220mA
LED1 LED2 = SZYY0603Y: Emitted Color:Yellow Power Dissipation:40mW Forward Current:10mA Dominant Wavelength:584nm~594nm Dominant Wavelength:584nm~594nm Peak Wavelength:596nm Diode Configuration:- Lens Color:无色透明透镜 Color Temperature:- Color Temperature:- Viewing Angle:120° Mount; LCSC Part Name: 黄灯; Supplier Part: C434424; Manufacturer: yongyu(永裕光电); Supplier Footprint: 0603; JLCPCB Part Class: Extended Part; Datasheet: https://atta.szlcsc.com/upload/public/pdf/source/20191204/C434424_CFFF7E61E87E340D5EF2F7BE4F7F7CA5.pdf; Supplier: LCSC; Emitted Color: Yellow; Power Dissipation: 40mW; Forward Current: 10mA; Dominant Wavelength: 584nm~594nm; Peak Wavelength: 596nm; Lens Color: 无色透明透镜; Viewing Angle: 120°; Operating Temperature: -40℃~+85℃
R2 = 0603WAF2200T5E: Type:Thick Film Resistors Resistance: Tolerance:±1% Tolerance:±1% Power(Watts): Overload Voltage (Max): Temperature Coefficient:±100ppm/℃ Temperature Coefficient:±100ppm/℃ Operating Temperature Range:-55℃~+155℃ Operating Temperature Range:-55℃~+155℃; LCSC Part Name: 220Ω ±1% 100mW 厚膜电阻; Supplier Part: C22962; Manufacturer: UNI-ROYAL(厚声); Supplier Footprint: 0603; JLCPCB Part Class: Basic Part; Datasheet: https://atta.szlcsc.com/upload/public/pdf/source/20200306/C422600_1E6D84923E4A46A82E41ADD87F860B5C.pdf; Supplier: LCSC; Type: Thick Film Resistors; Tolerance: ±1%; Temperature Coefficient: ±100ppm/℃; Operating Temperature Range: -55℃~+155℃
R3 = RC0603FR-07330RL: Type:Thick Film Resistors Resistance: Tolerance:±1% Tolerance:±1% Power(Watts): Overload Voltage (Max): Temperature Coefficient:±100ppm/℃ Temperature Coefficient:±100ppm/℃ Operating Temperature Range:-55℃~+155℃ Operating Temperature Range:-55℃~+155℃; LCSC Part Name: 厚膜电阻 330Ω ±1% 100mW; Supplier Part: C105881; Manufacturer: YAGEO(国巨); Supplier Footprint: 0603; JLCPCB Part Class: Extended Part; Datasheet: https://atta.szlcsc.com/upload/public/pdf/source/20180821/C275644_0D56F95EFF785E7D9A1FEF436B37DA78.pdf; Supplier: LCSC; Type: Thick Film Resistors; Tolerance: ±1%; Temperature Coefficient: ±100ppm/℃; Operating Temperature Range: -55℃~+155℃
R4 R30 = RC0603FR-074K7L: Type:Thick Film Resistors Resistance: Tolerance:±1% Tolerance:±1% Power(Watts): Overload Voltage (Max): Temperature Coefficient:±100ppm/℃ Temperature Coefficient:±100ppm/℃ Operating Temperature Range:-55℃~+155℃ Operating Temperature Range:-55℃~+155℃; LCSC Part Name: 厚膜电阻 4.7kΩ ±1% 100mW; Supplier Part: C99782; Manufacturer: YAGEO(国巨); Supplier Footprint: 0603; JLCPCB Part Class: Extended Part; Datasheet: https://atta.szlcsc.com/upload/public/pdf/source/20180224/C181757_15194369480721363983.pdf; Supplier: LCSC; Type: Thick Film Resistors; Tolerance: ±1%; Temperature Coefficient: ±100ppm/℃; Operating Temperature Range: -55℃~+155℃
R31 = FRC0603J132TS: Type:Thick Film Resistors Resistance:1.3kΩ Tolerance:±5% Tolerance:±5% Power(Watts): Overload Voltage (Max): Temperature Coefficient:±100ppm/℃ Temperature Coefficient:±100ppm/℃ Operating Temperature Range:-55℃~+155℃ Operating Temperature Range:-55℃~+155℃; LCSC Part Name: 1.3kΩ ±5% 100mW 厚膜电阻; Supplier Part: C2930022; Manufacturer: FOJAN(富捷); Supplier Footprint: 0603; JLCPCB Part Class: Extended Part; Datasheet: https://atta.szlcsc.com/upload/public/pdf/source/20211221/925EC7D7225764EE0046F22065062C87.pdf; Supplier: LCSC; Type: Thick Film Resistors; Tolerance: ±5%; Temperature Coefficient: ±100ppm/℃; Operating Temperature Range: -55℃~+155℃
U1 = LM2594D-5.0RG: Function:- Output Type:- Voltage - Supply:- Voltage - Supply:- Output Voltage:5V Output Voltage:5V Output Current:1A Frequency - Switching:150kHz Frequency - Switching:150kHz Operating Temperature:-40℃~+125℃ Operating Temperature:-40℃~+125℃ Number of Outp; LCSC Part Name: 1A 150KHz 固定频率 PWM DC-DC 稳压电源转换器; Supplier Part: C5145319; Manufacturer: HGC(深圳汉芯); Supplier Footprint: SOP-8; JLCPCB Part Class: Extended Part; Datasheet: https://atta.szlcsc.com/upload/public/pdf/source/20240701/55150577186580394B6D4007AE3EE027.pdf; Supplier: LCSC; Output Voltage: 5V; Output Current: 1A; Frequency - Switching: 150kHz; Operating Temperature: -40℃~+125℃; Number of Outputs: 1
U2 = AMS1117-3.3_C347222: Output Type:Fixed Voltage - Supply:12V Output Voltage:3.3V Output Voltage:3.3V Output Current:1A Power Supply Rejection Ratio (PSRR):60dB@(120Hz) Voltage Dropout:1.3V@(1A) standby current:- Noise:- Features:Overcurrent Protection Operating Temperature:- O; LCSC Part Name: 输出:3.3V 电流:1A 耐压:12V; Supplier Part: C347222; Manufacturer: UMW(友台半导体); Supplier Footprint: SOT-223; JLCPCB Part Class: Extended Part; Datasheet: https://atta.szlcsc.com/upload/public/pdf/source/20241218/BAF0263FA2E44BCD8AF41AA4FA04EFAA.pdf; Supplier: LCSC; Output Type: Fixed; Voltage - Supply: 12V; Output Voltage: 3.3V; Output Current: 1A; Power Supply Rejection Ratio (PSRR): 60dB@(120Hz); Voltage Dropout: 1.3V@(1A); Features: Overcurrent Protection; Output Configuration: Positive electrode; Number of Outputs: 1
U3 = B0505S-1W_C882272: Conversion Type:DC-DC Input Voltage(DC):5V Input Voltage(DC):5V Output Voltage:5V Output Voltage:5V Output Power:1W Output Current (Max):200mA Output Current (Max):200mA Isolation or not:隔离 Output Channel:1 Insulated Voltage:1.5kV Conversion Efficiency:76; LCSC Part Name: 电源模块; Supplier Part: C882272; Manufacturer: VISOM; Supplier Footprint: 插件; JLCPCB Part Class: Extended Part; Datasheet: https://atta.szlcsc.com/upload/public/pdf/source/20201026/C882272_824B6AABD52E4FF2DB9DFDBC5DF043CA.pdf; Supplier: LCSC; Conversion Type: DC-DC; Input Voltage(DC): 5V; Output Voltage: 5V; Output Power: 1W; Output Current (Max): 200mA; Isolation or not: 隔离; Output Channel: 1; Insulated Voltage: 1.5kV; Conversion Efficiency: 76%; Maximum Capacitive Load: 47uF
U4 = HT7533-1_C347186: Output Type:Fixed Maximum Input Voltage:30V Output Voltage:3.3V Output Voltage:3.3V Output Current:100mA Power Supply Rejection Ratio (PSRR):- Dropout Voltage:100mV@(1mA) standby current:3uA Noise:- Operating Temperature:-25℃~+70℃ Operating Temperature:-2; LCSC Part Name: 输入30V 输出3.3V 100mA; Supplier Part: C347186; Manufacturer: UMW(友台半导体); Supplier Footprint: SOT-89; JLCPCB Part Class: Extended Part; Datasheet: https://atta.szlcsc.com/upload/public/pdf/source/20241210/442D8F583BE08BBCCA568BF38D964031.pdf; Supplier: LCSC; Output Type: Fixed; Maximum Input Voltage: 30V; Output Voltage: 3.3V; Output Current: 100mA; Dropout Voltage: 100mV@(1mA); standby current: 3uA; Operating Temperature: -25℃~+70℃; Output Polarity: Positive electrode; Number of Outputs: 1
U5 = CJ78M05_C9070: Output Type:Fixed Voltage - Supply:35V Output Voltage:5V Output Voltage:5V Output Current:500mA Voltage Dropout:2V@(350mA) Output Configuration:Positive electrode Number of Outputs:1; LCSC Part Name: 输入35V 输出5V 500mA; Supplier Part: C9070; Manufacturer: CJ(江苏长电/长晶); Supplier Footprint: TO-252-2L; JLCPCB Part Class: Extended Part; Datasheet: https://atta.szlcsc.com/upload/public/pdf/source/20210111/C9070_E2FF01A9F6B05C87D7EE5304EE03ECDB.pdf; Supplier: LCSC; Output Type: Fixed; Voltage - Supply: 35V; Output Voltage: 5V; Output Current: 500mA; Voltage Dropout: 2V@(350mA); Output Configuration: Positive electrode; Number of Outputs: 1

## Nets
+3V3: C9.1 C19.2 C20.2 C21.2 C22.2 C23.2 C24.2 H1.2 LED1.2(-) R4.1 U2.2(VOUT(TAB)) U4.3(VOUT) U7.1(VCC1)
+3v3: U9.1(VBAT) U9.13(VDDA) U9.19(VDD) U9.32(VDD) U9.48(VDD) U9.64(VDD)
+5V: C2.2 C4.2 C5.2 C10.2 CN3.1 CN4.1 D11.2(K) L1.2 L2.1 LED2.2(-) U1.4(FB) U2.3(VIN) U5.3(Vout)
+5V_ISOL: C8.2 U3.4(Vo) U7.8(VCC2)
GND: C1.1 C2.1 C3.2 C4.1 C5.1 C6.1 C7.2 C9.2 C10.1 C13.2 C14.2 C15.1 C16.2 C17.2 C19.1 C20.1 C21.1 C22.1 C23.1 C24.1 C25.2 C26.2 C27.2 C28.2 C29.2 C30.2 CN3.4 CN4.4 D1.2(A) D4.1(K) D5.2 D6.2 D7.2 D8.2 D9.2 D10.2 D12.2 GND.1 H1.6 P7.1 P8.1 P9.1 P10.1 P11.1 P12.1 R2.1 R3.1 R5.1 R14.1 R15.1 R20.1 R21.1 R26.1 R27.1 R29.2 R31.1 U1.6(GND) U2.1(ADJ(GND)) U3.1(GND) U4.1(GND) U5.2(GND) U7.4(GND1) U9.12(VSSA) U9.18(VSS) U9.60(BOOT0) U9.63(VSS) U16.2 U16.5 USBC1.0(SH) USBC1.1(SH) USBC1.2(SH) USBC1.3(SH) USBC1.A1(GND) USBC1.A12(GND) USBC1.B1(GND) USBC1.B12(GND)
GND_ISOL2: C18.2 U8.3
PGND: C8.1 U3.3(0V) U7.5(GND2)
VCC: C1.2 C6.2 C13.1 R30.2 U1.7(VIN) U4.2(VIN) U5.1(Vin) U10.6(vbb) U11.6(vbb) U12.6(vbb) U13.6(vbb) U14.6(vbb) U15.6(vbb) VCC.1
ADC_VCC: D12.1 R30.1 R31.2 U9.15(PA1)
CAN1_H: CN1.1 R6.2 R7.1 U8.1
CAN1_L: CN1.2 R8.2 R9.1 U8.2
CAN1_RX: U7.2(RXD) U9.61(PB8)
CAN1_TX: U7.3(TXD) U9.62(PB9)
F_SWCLK: H1.4 U9.49(PA14(JTCK-SWCLK))
F_SWDIO: H1.3 U9.46(PA13(JTMS-SWDIO))
F_SWO: H1.1 U9.55(PB3(JTDOTRACESWO))
IN_1: R10.1 U9.35(PB14)
IN_2: R17.1 U9.36(PB15)
IN_3: R23.1 U9.37(PC6)
IN_4: R11.1 U9.38(PC7)
IN_5: R16.1 U9.39(PC8)
IN_6: R22.1 U9.40(PC9)
IS_1: C25.1 D5.1 R12.1 U9.20(PA4)
IS_2: C28.1 D8.1 R19.1 U9.21(PA5)
IS_3: C30.1 D10.1 R25.1 U9.22(PA6)
IS_4: C26.1 D6.1 R13.1 U9.23(PA7)
IS_5: C27.1 D7.1 R18.1 U9.24(PC4)
IS_6: C29.1 D9.1 R24.1 U9.25(PC5)
LM_EN: R4.2 U1.5(ON#/OFF) U9.34(PB13)
NRST: C15.2 H1.5 R5.2 U9.7(NRST)
OUT_1: P1.1 U10.1(OUT) U10.5(OUT)
OUT_2: P2.1 U13.1(OUT) U13.5(OUT)
OUT_3: P3.1 U15.1(OUT) U15.5(OUT)
OUT_4: P4.1 U11.1(OUT) U11.5(OUT)
OUT_5: P5.1 U12.1(OUT) U12.5(OUT)
OUT_6: P6.1 U14.1(OUT) U14.5(OUT)
USART1_RX: CN4.3 U9.43(PA10)
USART1_TX: CN4.2 U9.42(PA9)
USART2_RX: CN3.3 U9.17(PA3)
USART2_TX: CN3.2 U9.16(PA2)
USB_OTG_FS_DM: U9.44(PA11) U16.1 USBC1.A7(DN1) USBC1.B7(DN2)
USB_OTG_FS_DP: U9.45(PA12) U16.3 USBC1.A6(DP1) USBC1.B6(DP2)
USB_OTG_VBUS: R28.2 R29.1 U9.41(PA8)
$1N255: D1.1(K) L1.1 U1.8(OUTPUT)
$1N2118: LED2.1(+) R3.2
$1N2161: LED1.1(+) R2.2
$1N2679: C7.1 L2.2 U3.2(Vin)
$2N1672: C16.1 U9.47(VCAP_2)
$2N1673: C17.1 U9.31(VCAP_1)
$2N1688: C18.1 R7.2 R9.2
$2N1692: R6.1 U7.7(CANH)
$2N1693: R8.1 U7.6(CANL)
$2N1694: C3.1 U9.5(PH0-OSC_IN(PH0)) X1.1
$2N1695: C14.1 U9.6(PH1-OSC_OUT(PH1)) X1.3
$2N1698: D4.2(A) R1.1
$2N1700: R1.2 U9.26(PB0)
$2N3193: F1.2 USBC1.A4(VBUS) USBC1.A9(VBUS) USBC1.B4(VBUS) USBC1.B9(VBUS)
$2N3573: D11.1(A) F1.1 R28.1
$3N493: R12.2 R14.2 U10.4(IS)
$3N494: R10.2 U10.2(IN)
$3N881: R19.2 R21.2 U13.4(IS)
$3N886: R17.2 U13.2(IN)
$3N1191: R25.2 R27.2 U15.4(IS)
$3N1196: R23.2 U15.2(IN)
$3N1501: R13.2 R15.2 U11.4(IS)
$3N1506: R11.2 U11.2(IN)
$3N1811: R18.2 R20.2 U12.4(IS)
$3N1816: R16.2 U12.2(IN)
$3N2121: R24.2 R26.2 U14.4(IS)
$3N2126: R22.2 U14.2(IN)

Not connected (* = marked no-connect by the designer): U1 1(NC)* 2(NC)* 3(NC)*; U2 4(TAB); U9 2(PC13) 3(PC14-OSC32_IN(PC14)) 4(PC15-OSC32_OUT(PC15)) 8(PC0) 9(PC1) 10(PC2) 11(PC3) 14(PA0-WKUP(PA0)) 27(PB1) 28(PB2-BOOT1(PB2)) 29(PB10) 30(PB11) 33(PB12) 50(PA15(JTDI)) 51(PC10) 52(PC11) 53(PC12) 54(PD2) 56(PB4(NJTRST)) 57(PB5) 58(PB6) 59(PB7); U16 4* 6*; USBC1 A5(CC1)* A8(SBU1)* B5(CC2)* B8(SBU2)*; X1 2(GND)* 4(GND)*
